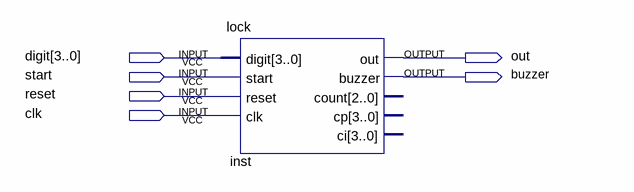
[diagram p0: schematic sheet]
// Quartus schematic blk_diagram.bdf as structural Verilog: 1 symbols, 6 pins
module blk_diagram (
  input  [3:0] digit,
  input  start,
  input  reset,
  input  clk,
  output out,
  output buzzer
);

  lock inst (
    .digit(digit), .start(start), .reset(reset), .clk(clk), .out(out), .buzzer(buzzer));  // open: count, cp, ci
endmodule
